# Altium schematic sheet RFR24 AMS Design - LTC6820 V1.SchDoc
size A; SheetNumber: 3; SheetTotal: 10
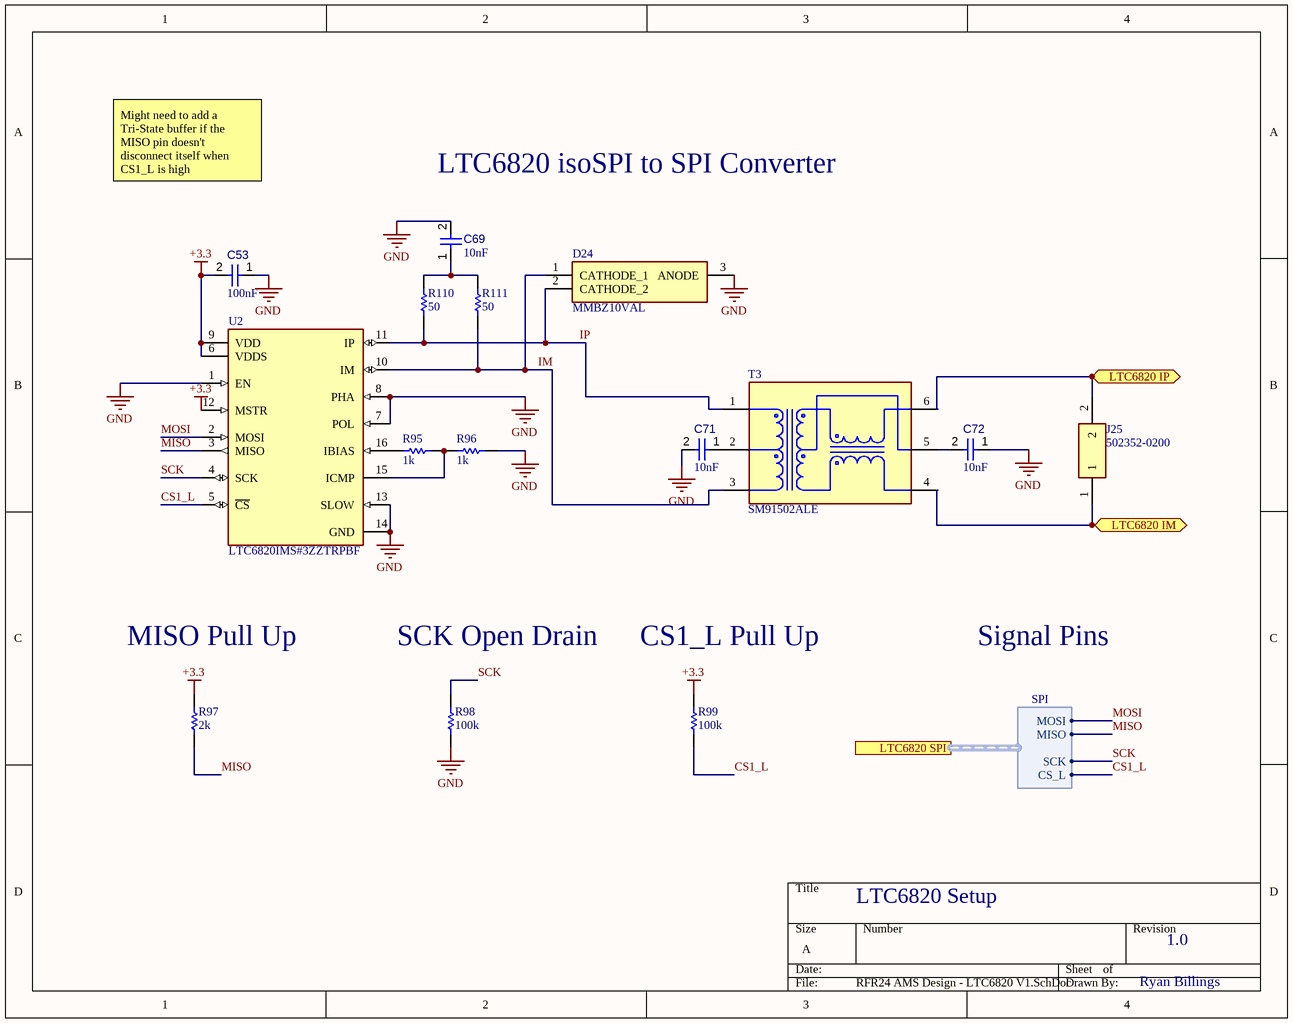
[diagram p0: RFR24 AMS Design - LTC6820 V1.SchDoc]

## Parts
C53  value 100nF  [CAPC2013X145X50LL20T25]  (hidden comment: Capacitor 1 uF +/- 10% 25 V 0805)
C69  value 10nF  [CAPC2013X145X50LL20T25]  (hidden comment: Capacitor 1 uF +/- 10% 25 V 0805)
C71  value 10nF  [CAPC2013X145X50LL20T25]  (hidden comment: Capacitor 1 uF +/- 10% 25 V 0805)
C72  value 10nF  [CAPC2013X145X50LL20T25]  (hidden comment: Capacitor 1 uF +/- 10% 25 V 0805)
D24  MMBZ10VAL  [SOT95P230X110-3N]
J25  502352-0200  [5023520200]
R95  value 1k  [RESC2013X70X40LL20T20]  (hidden comment: Resistor 1k +/-1% 0805 125 mW)
R96  value 1k  [RESC2013X70X40LL20T20]  (hidden comment: Resistor 1k +/-1% 0805 125 mW)
R97  value 2k  [RESC2013X70X40LL20T20]  (hidden comment: Resistor 1k +/-1% 0805 125 mW)
R98  value 100k  [RESC2013X70X40LL20T20]  (hidden comment: Resistor 1k +/-1% 0805 125 mW)
R99  value 100k  [RESC2013X70X40LL20T20]  (hidden comment: Resistor 1k +/-1% 0805 125 mW)
R110  value 50  [RESC2013X70X40LL20T20]  (hidden comment: Resistor 1k +/-1% 0805 125 mW)
R111  value 50  [RESC2013X70X40LL20T20]  (hidden comment: Resistor 1k +/-1% 0805 125 mW)
T3  SM91502ALE  [FP-SM91502ALE-MFG]
U2  LTC6820IMS#3ZZTRPBF  [FP-MS-16-05-08-1669-IPC_C]

## Ports
LTC6820 IM (bidir), LTC6820 IP (bidir), LTC6820 SPI (harness SPI)

## Harnesses
SPI: MOSI, MISO, SCK, CS_L

## Nets
+3.3: C53.2 R97.2 R99.2 U2.6(VDDS) U2.9(VDD) U2.12(MSTR)
GND: C53.1 C69.2 C71.2 C72.1 D24.3(ANODE) R96.2 R98.1 U2.1(EN) U2.7(POL) U2.8(PHA) U2.13(SLOW) U2.14(GND)
CS1_L: R99.1 U2.5(~{CS}) ; port LTC6820 SPI.CS_L
IM: D24.1(CATHODE_1) R111.1 T3.3 U2.10(IM)
IP: D24.2(CATHODE_2) R110.1 T3.1 U2.11(IP)
LTC6820 IM: J25.1 T3.4 ; port LTC6820 IM
LTC6820 IP: J25.2 T3.6 ; port LTC6820 IP
MISO: R97.1 U2.3(MISO) ; port LTC6820 SPI.MISO
MOSI: U2.2(MOSI) ; port LTC6820 SPI.MOSI
SCK: R98.2 U2.4(SCK) ; port LTC6820 SPI.SCK
NetC69_1: C69.1 R110.2 R111.2
NetC71_1: C71.1 T3.2
NetC72_2: C72.2 T3.5
NetR95_1: R95.1 U2.16(IBIAS)
NetR95_2: R95.2 R96.1 U2.15(ICMP)

## Notes on the sheet
- Might need to add a Tri-State buffer if the MISO pin doesn't disconnect itself when CS1_L is high
- LTC6820 isoSPI to SPI Converter
- MISO Pull Up
- SCK Open Drain
- CS1_L Pull Up
- Signal Pins
- LTC6820 Setup
- 1.0
- Ryan Billings

## Library data of the parts
C53 C69 C71 C72 = CMP-001-00010-6: Chip Capacitor, 1 uF, +/-10%, 25 V, 0805 (2012 Metric); Capacitor Type: Ceramic; Voltage Rating: 25V; RoHS Compliant: True; Pins: 2; Mounting Technology: SM; Max Operating Temperature: 125°C; Min Operating Temperature: -55°C; Tolerance: 10%; Case/Package: 0805
D24 = MMBZ10VAL: TVS Diode (Uni-directional); Manufacturer_Name: Nexperia; Datasheet Link: https://componentsearchengine.com/Datasheets/2/MMBZ10VAL.pdf; Height: 1.1mm; Manufacturer_Part_Number: MMBZ10VAL; Mouser Part Number: N/A; Mouser Price/Stock: https://www.mouser.co.uk/ProductDetail/Nexperia/MMBZ10VAL?qs=vHuUswq2%252Bsyln3ntzeiFlQ%3D%3D
J25 = 502352-0200: Connector; Manufacturer_Name: Molex; Datasheet Link: https://www.molex.com/pdm_docs/sd/5023520200_sd.pdf; Manufacturer_Part_Number: 502352-0200; Mouser Part Number: 538-502352-0200; Mouser Price/Stock: https://www.mouser.co.uk/ProductDetail/Molex/502352-0200?qs=cPOO8qjhL6OPJnOOkJoW%252Bw%3D%3D; Arrow Part Number: 502352-0200; Arrow Price/Stock: https://www.arrow.com/en/products/5023520200/molex?region=europe
R95-R99 R110 R111 = CMP-009-00010-5: Chip Resistor, 1 KOhm, +/- 1%, 0.125 W, -55 to 155 degC, 0805 (2013 Metric); Power: 125mW; Voltage Rating: 150V; Tolerance: 1%; RoHS Compliant: True; Mounting Technology: SM; Pins: 2; Case/Package: 0805; Max Operating Temperature: 155°C; Min Operating Temperature: -55°C
T3 = CMP-07264-000001-1: BMS XFORMER 1-CH 1000V AECQ +125; Manufacturer: Bourns; Standoff Height: 0.13mm; Turns Ratio: 1:1; Automotive Grade: Grade 1; Isolation Voltage: 4300VDC; Return Loss: -22dB; Insertion Loss: -0.25dB; Height: 5.72mm; Automotive: Yes; Package: 0; Device Class L3: unset; ComponentLink2Description: Datasheet; Category: Trans; ComponentLink2URL: https://www.bourns.com/docs/product-datasheets/SM91502AL.pdf; Device Class L1: Passive Components; Manufacturer Part Number: SM91502ALE; Temperature Range High: +125°C; Digikey Description: BMS XFORMER 1-CH 1000V AECQ +125; RoHS: TRUE; Lead Free: Yes; Octopart: https://octopart.com/sm91502ale-bourns-95732123; Device Class L2: Transformers; Temperature: -40°C to +125°C; Temperature Range Low: -40°C
U2 = CMP-09093-000139-1: IC INTERFACE SPECIALIZED 16MSOP